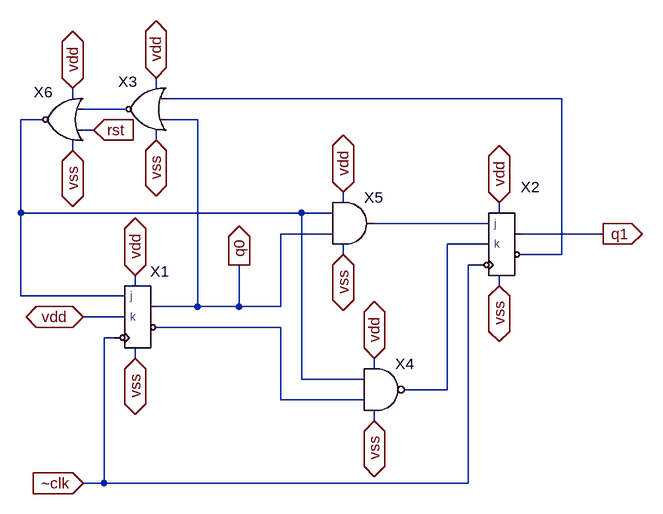
[diagram p0: schematic mod_3_counter.asc]
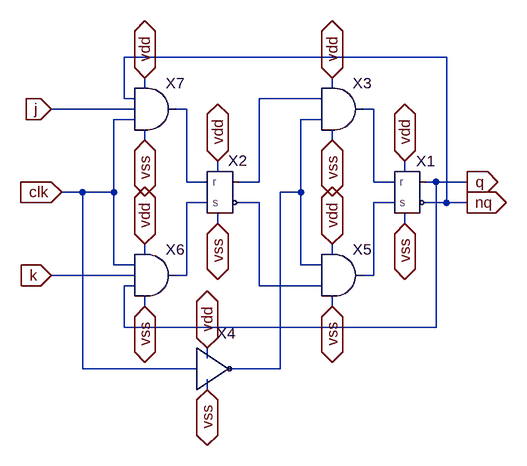
[diagram p1: sub-circuit jk_flip_flop.asc]
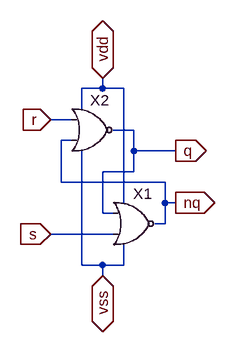
[diagram p2: sub-circuit sr_latch.asc]
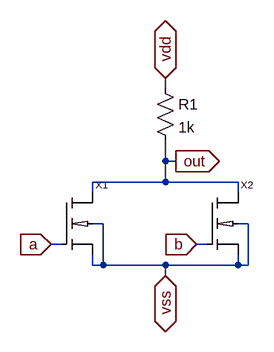
[diagram p3: sub-circuit nor.asc]
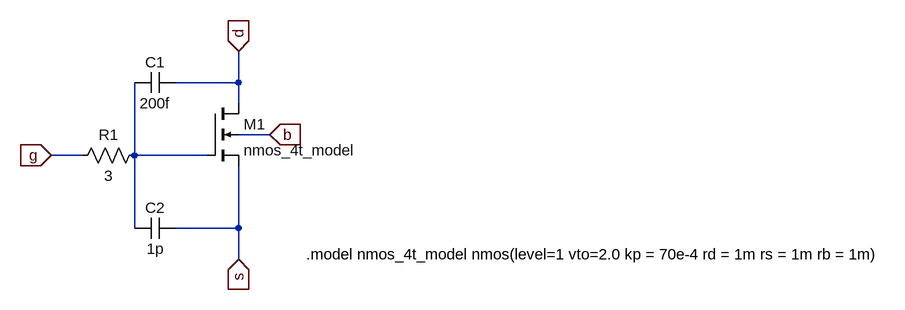
[diagram p4: sub-circuit nmos_4t.asc]
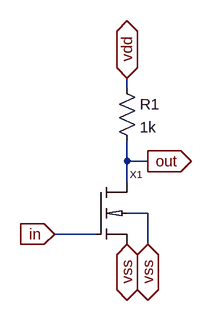
[diagram p5: sub-circuit not.asc]
mod_3_counter.asc, the LTspice schematic file:
Version 4
SHEET 1 920 680
WIRE -160 -192 -160 -208
WIRE -288 -176 -288 -192
WIRE 464 -176 -144 -176
WIRE -208 -160 -272 -160
WIRE -336 -144 -368 -144
WIRE -96 -144 -144 -144
WIRE -256 -128 -272 -128
WIRE -160 -112 -160 -128
WIRE -288 -96 -288 -112
WIRE 128 -16 128 -32
WIRE -368 0 -368 -144
WIRE 64 0 -368 0
WIRE 112 0 64 0
WIRE 368 0 368 -16
WIRE 352 16 176 16
WIRE 112 32 32 32
WIRE 528 32 400 32
WIRE 352 48 288 48
WIRE 128 64 128 48
WIRE 464 64 464 -176
WIRE 464 64 400 64
WIRE 336 80 320 80
WIRE -192 112 -192 96
WIRE 368 112 368 96
WIRE -368 128 -368 0
WIRE -208 128 -368 128
WIRE -96 144 -96 -144
WIRE -96 144 -160 144
WIRE -32 144 -32 80
WIRE -32 144 -96 144
WIRE 32 144 32 32
WIRE 32 144 -32 144
WIRE -208 160 -272 160
WIRE 32 176 -160 176
WIRE -224 192 -240 192
WIRE -192 224 -192 208
WIRE 176 240 176 224
WIRE 64 256 64 0
WIRE 160 256 64 256
WIRE 288 272 288 48
WIRE 288 272 224 272
WIRE 32 288 32 176
WIRE 160 288 32 288
WIRE 176 320 176 304
WIRE -240 416 -240 192
WIRE -240 416 -272 416
WIRE 320 416 320 80
WIRE 320 416 -240 416
FLAG -272 416 ~clk
IOPIN -272 416 In
FLAG -32 80 q0
IOPIN -32 80 Out
FLAG 528 32 q1
IOPIN 528 32 Out
FLAG -272 160 vdd
IOPIN -272 160 BiDir
FLAG -192 224 vss
IOPIN -192 224 BiDir
FLAG 368 112 vss
IOPIN 368 112 BiDir
FLAG 368 -16 vdd
IOPIN 368 -16 BiDir
FLAG -192 96 vdd
IOPIN -192 96 BiDir
FLAG 128 64 vss
IOPIN 128 64 BiDir
FLAG 128 -32 vdd
IOPIN 128 -32 BiDir
FLAG 176 224 vdd
IOPIN 176 224 BiDir
FLAG 176 320 vss
IOPIN 176 320 BiDir
FLAG -256 -128 rst
IOPIN -256 -128 In
FLAG -160 -112 vss
IOPIN -160 -112 BiDir
FLAG -160 -208 vdd
IOPIN -160 -208 BiDir
FLAG -288 -192 vdd
IOPIN -288 -192 BiDir
FLAG -288 -96 vss
IOPIN -288 -96 BiDir
SYMBOL jk_flip_flop -144 160 R0
WINDOW 0 -10 -54 Bottom 2
SYMATTR InstName X1
SYMBOL jk_flip_flop 416 48 R0
SYMATTR InstName X2
SYMBOL nand 192 208 R0
SYMATTR InstName X4
SYMBOL and 144 -48 R0
SYMATTR InstName X5
SYMBOL nor -176 -224 M0
WINDOW 0 13 22 Left 2
SYMATTR InstName X3
SYMBOL nor -304 -208 M0
WINDOW 0 15 22 Left 2
SYMATTR InstName X6

jk_flip_flop.asc, the sub-circuit schematic file:
Version 4
SHEET 1 880 680
WIRE 352 -160 -144 -160
WIRE -112 -112 -112 -128
WIRE 176 -112 176 -128
WIRE -144 -96 -144 -160
WIRE -128 -96 -144 -96
WIRE 160 -96 64 -96
WIRE -128 -80 -256 -80
WIRE -48 -80 -64 -80
WIRE 240 -80 224 -80
WIRE -128 -64 -160 -64
WIRE 160 -64 128 -64
WIRE -112 -32 -112 -48
WIRE 176 -32 176 -48
WIRE 0 16 0 0
WIRE 288 16 288 0
WIRE -48 32 -48 -80
WIRE -16 32 -48 32
WIRE 64 32 64 -96
WIRE 64 32 32 32
WIRE 240 32 240 -80
WIRE 272 32 240 32
WIRE 336 32 320 32
WIRE 384 32 336 32
WIRE -208 48 -240 48
WIRE -160 48 -160 -64
WIRE -160 48 -208 48
WIRE 128 48 128 -64
WIRE 128 48 96 48
WIRE -16 64 -48 64
WIRE 64 64 32 64
WIRE 272 64 240 64
WIRE 352 64 352 -160
WIRE 352 64 320 64
WIRE 384 64 352 64
WIRE 0 96 0 80
WIRE 288 96 288 80
WIRE -112 144 -112 128
WIRE 176 144 176 128
WIRE -160 160 -160 48
WIRE -128 160 -160 160
WIRE 128 160 128 48
WIRE 160 160 128 160
WIRE -128 176 -256 176
WIRE -48 176 -48 64
WIRE -48 176 -64 176
WIRE 240 176 240 64
WIRE 240 176 224 176
WIRE -128 192 -144 192
WIRE 64 192 64 64
WIRE 160 192 64 192
WIRE -112 224 -112 208
WIRE 176 224 176 208
WIRE -144 256 -144 192
WIRE 336 256 336 32
WIRE 336 256 -144 256
WIRE -16 304 -16 288
WIRE -208 320 -208 48
WIRE -32 320 -208 320
WIRE 96 320 96 48
WIRE 96 320 16 320
WIRE -16 352 -16 336
FLAG -112 -128 vdd
IOPIN -112 -128 BiDir
FLAG 176 -128 vdd
IOPIN 176 -128 BiDir
FLAG 288 0 vdd
IOPIN 288 0 BiDir
FLAG -112 128 vdd
IOPIN -112 128 BiDir
FLAG 176 128 vdd
IOPIN 176 128 BiDir
FLAG 0 0 vdd
IOPIN 0 0 BiDir
FLAG -112 224 vss
IOPIN -112 224 BiDir
FLAG 176 -32 vss
IOPIN 176 -32 BiDir
FLAG -112 -32 vss
IOPIN -112 -32 BiDir
FLAG 176 224 vss
IOPIN 176 224 BiDir
FLAG 288 96 vss
IOPIN 288 96 BiDir
FLAG 0 96 vss
IOPIN 0 96 BiDir
FLAG -16 352 vss
IOPIN -16 352 BiDir
FLAG -16 288 vdd
IOPIN -16 288 BiDir
FLAG 384 32 q
IOPIN 384 32 Out
FLAG 384 64 nq
IOPIN 384 64 Out
FLAG -256 -80 j
IOPIN -256 -80 In
FLAG -256 176 k
IOPIN -256 176 In
FLAG -240 48 clk
IOPIN -240 48 In
SYMBOL sr_latch 304 48 R0
WINDOW 0 16 -32 Bottom 2
SYMATTR InstName X1
SYMBOL sr_latch 16 48 R0
WINDOW 0 15 -33 Bottom 2
SYMATTR InstName X2
SYMBOL not -32 320 R0
WINDOW 0 45 -39 Bottom 2
SYMATTR InstName X4
SYMBOL and 192 112 R0
SYMATTR InstName X5
SYMBOL 3_way_and -96 112 R0
SYMATTR InstName X6
SYMBOL and 192 -144 R0
SYMATTR InstName X3
SYMBOL 3_way_and -96 -144 R0
SYMATTR InstName X7

sr_latch.asc, the sub-circuit schematic file:
Version 4
SHEET 1 880 680
WIRE 208 0 208 -16
WIRE 208 0 176 0
WIRE 240 0 208 0
WIRE 176 32 176 0
WIRE 160 48 128 48
WIRE 256 64 224 64
WIRE 160 80 144 80
WIRE 256 96 256 64
WIRE 320 96 256 96
WIRE 256 128 256 96
WIRE 256 128 208 128
WIRE 144 144 144 80
WIRE 304 144 144 144
WIRE 240 176 240 0
WIRE 304 176 304 144
WIRE 320 176 304 176
WIRE 208 192 208 128
WIRE 224 192 208 192
WIRE 304 208 304 176
WIRE 304 208 288 208
WIRE 224 224 128 224
WIRE 176 272 176 96
WIRE 208 272 176 272
WIRE 240 272 240 240
WIRE 240 272 208 272
WIRE 208 288 208 272
FLAG 128 224 s
IOPIN 128 224 In
FLAG 128 48 r
IOPIN 128 48 In
FLAG 320 96 q
IOPIN 320 96 Out
FLAG 320 176 nq
IOPIN 320 176 Out
FLAG 208 288 vss
IOPIN 208 288 BiDir
FLAG 208 -16 vdd
IOPIN 208 -16 BiDir
SYMBOL nor 256 144 R0
WINDOW 0 -1 18 Left 2
SYMATTR InstName X1
SYMBOL nor 192 0 R0
WINDOW 0 -3 18 Left 2
SYMATTR InstName X2

nor.asc, the sub-circuit schematic file:
Version 4
SHEET 1 880 680
WIRE 240 48 240 32
WIRE 240 160 240 128
WIRE 256 160 240 160
WIRE 240 192 240 160
WIRE 240 192 128 192
WIRE 352 192 240 192
WIRE 128 208 128 192
WIRE 352 208 352 192
WIRE 144 256 128 256
WIRE 368 256 352 256
WIRE 80 288 64 288
WIRE 304 288 288 288
WIRE 128 320 128 304
WIRE 144 320 144 256
WIRE 144 320 128 320
WIRE 240 320 144 320
WIRE 352 320 352 304
WIRE 352 320 240 320
WIRE 368 320 368 256
WIRE 368 320 352 320
WIRE 240 336 240 320
FLAG 240 32 vdd
IOPIN 240 32 BiDir
FLAG 240 336 vss
IOPIN 240 336 BiDir
FLAG 256 160 out
IOPIN 256 160 Out
FLAG 288 288 b
IOPIN 288 288 In
FLAG 64 288 a
IOPIN 64 288 In
SYMBOL res 224 32 R0
SYMATTR InstName R1
SYMATTR Value 1k
SYMBOL nmos_4t 80 208 R0
SYMATTR InstName X1
SYMBOL nmos_4t 304 208 R0
SYMATTR InstName X2

nmos_4t.asc, the sub-circuit schematic file:
Version 4
SHEET 1 880 680
WIRE -288 -224 -288 -272
WIRE -288 -224 -384 -224
WIRE -288 -192 -288 -224
WIRE -240 -144 -288 -144
WIRE -528 -112 -576 -112
WIRE -448 -112 -448 -224
WIRE -336 -112 -448 -112
WIRE -448 0 -448 -112
WIRE -288 0 -288 -96
WIRE -288 0 -384 0
WIRE -288 48 -288 0
FLAG -576 -112 g
IOPIN -576 -112 In
FLAG -288 -272 d
IOPIN -288 -272 In
FLAG -288 48 s
IOPIN -288 48 In
FLAG -240 -144 b
IOPIN -240 -144 In
SYMBOL nmos4 -336 -192 R0
SYMATTR InstName M1
SYMATTR Value nmos_4t_model
SYMBOL cap -384 -240 R90
WINDOW 0 0 32 VBottom 2
WINDOW 3 32 32 VTop 2
SYMATTR InstName C1
SYMATTR Value 200f
SYMBOL cap -384 -16 R90
WINDOW 0 0 32 VBottom 2
WINDOW 3 32 32 VTop 2
SYMATTR InstName C2
SYMATTR Value 1p
SYMBOL res -432 -128 R90
WINDOW 0 0 56 VBottom 2
WINDOW 3 32 56 VTop 2
SYMATTR InstName R1
SYMATTR Value 3
TEXT -184 40 Left 2 !.model nmos_4t_model nmos(level=1 vto=2.0 kp = 70e-4 rd = 1m rs = 1m rb = 1m)

not.asc, the sub-circuit schematic file:
Version 4
SHEET 1 880 680
WIRE 176 -96 176 -112
WIRE 176 16 176 -16
WIRE 208 16 176 16
WIRE 176 48 176 16
WIRE 208 96 176 96
WIRE 128 128 64 128
WIRE 208 144 208 96
FLAG 64 128 in
IOPIN 64 128 In
FLAG 176 144 vss
IOPIN 176 144 BiDir
FLAG 176 -112 vdd
IOPIN 176 -112 BiDir
FLAG 208 16 out
IOPIN 208 16 Out
FLAG 208 144 vss
IOPIN 208 144 BiDir
SYMBOL res 160 -112 R0
SYMATTR InstName R1
SYMATTR Value 1k
SYMBOL nmos_4t 128 48 R0
SYMATTR InstName X1

The netlist it stands for:
* mod_3_counter.asc
XX1 ~clk N003 vdd N006 q0 vdd vss jk_flip_flop
XX2 ~clk N004 N005 N001 q1 vdd vss jk_flip_flop
XX4 N003 N006 vdd vss N005 nand  ; pins a b vdd vss out
XX5 N003 q0 vdd vss N004 and  ; pins a b vdd vss out
XX3 N001 q0 vdd vss N002 nor
XX6 N002 rst vdd vss N003 nor

* block symbol definitions
.subckt jk_flip_flop clk j k nq q vdd vss
XX1 N003 N007 nq q vdd vss sr_latch
XX2 N002 N005 N006 N001 vdd vss sr_latch
XX4 clk N004 vss vdd not
XX5 N004 N006 vdd vss N007 and  ; pins a b vdd vss out
XX6 clk k vdd vss N005 q 3_way_and  ; pins a b vdd vss out c
XX3 N001 N004 vdd vss N003 and  ; pins a b vdd vss out
XX7 nq j vdd vss N002 clk 3_way_and  ; pins a b vdd vss out c
.ends jk_flip_flop

.subckt sr_latch r s nq q vdd vss
XX1 q s vdd vss nq nor
XX2 r nq vdd vss q nor
.ends sr_latch

.subckt nor a b vdd vss out
R1 vdd out 1k
XX1 out a vss vss nmos_4t
XX2 out b vss vss nmos_4t
.ends nor

.subckt nmos_4t D G S B
M1 d N001 s b nmos_4t_model
C1 d N001 200f
C2 s N001 1p
R1 N001 g 3
.model nmos_4t_model nmos(level=1 vto=2.0 kp = 70e-4 rd = 1m rs = 1m rb = 1m)
.ends nmos_4t

.subckt not in out vss vdd
R1 vdd out 1k
XX1 out in vss vss nmos_4t
.ends not

.model NMOS NMOS
.model PMOS PMOS
.lib standard.mos
.backanno
.end